# Altium schematic sheet as14120_fpga_ddr.SchDoc
size A3; PageSetup: Record=PageOptions|CenterHorizontal=True|CenterVertical=True|PrintScale=1.02|XCorrection=1.00|YCorrection=1.00|PrintKind=1|BorderSize=5000000|LeftOffset=0|BottomOffset=0|Orientation=2|PaperLength=4200|PaperWidth=2970|Scale=100|PaperSource=7|PrintQuality=-4|MediaType=1|DitherType=10|PaperKind=A3 (бумага продольной резки) (297 x 420 мм)|PrintScaleMode=1
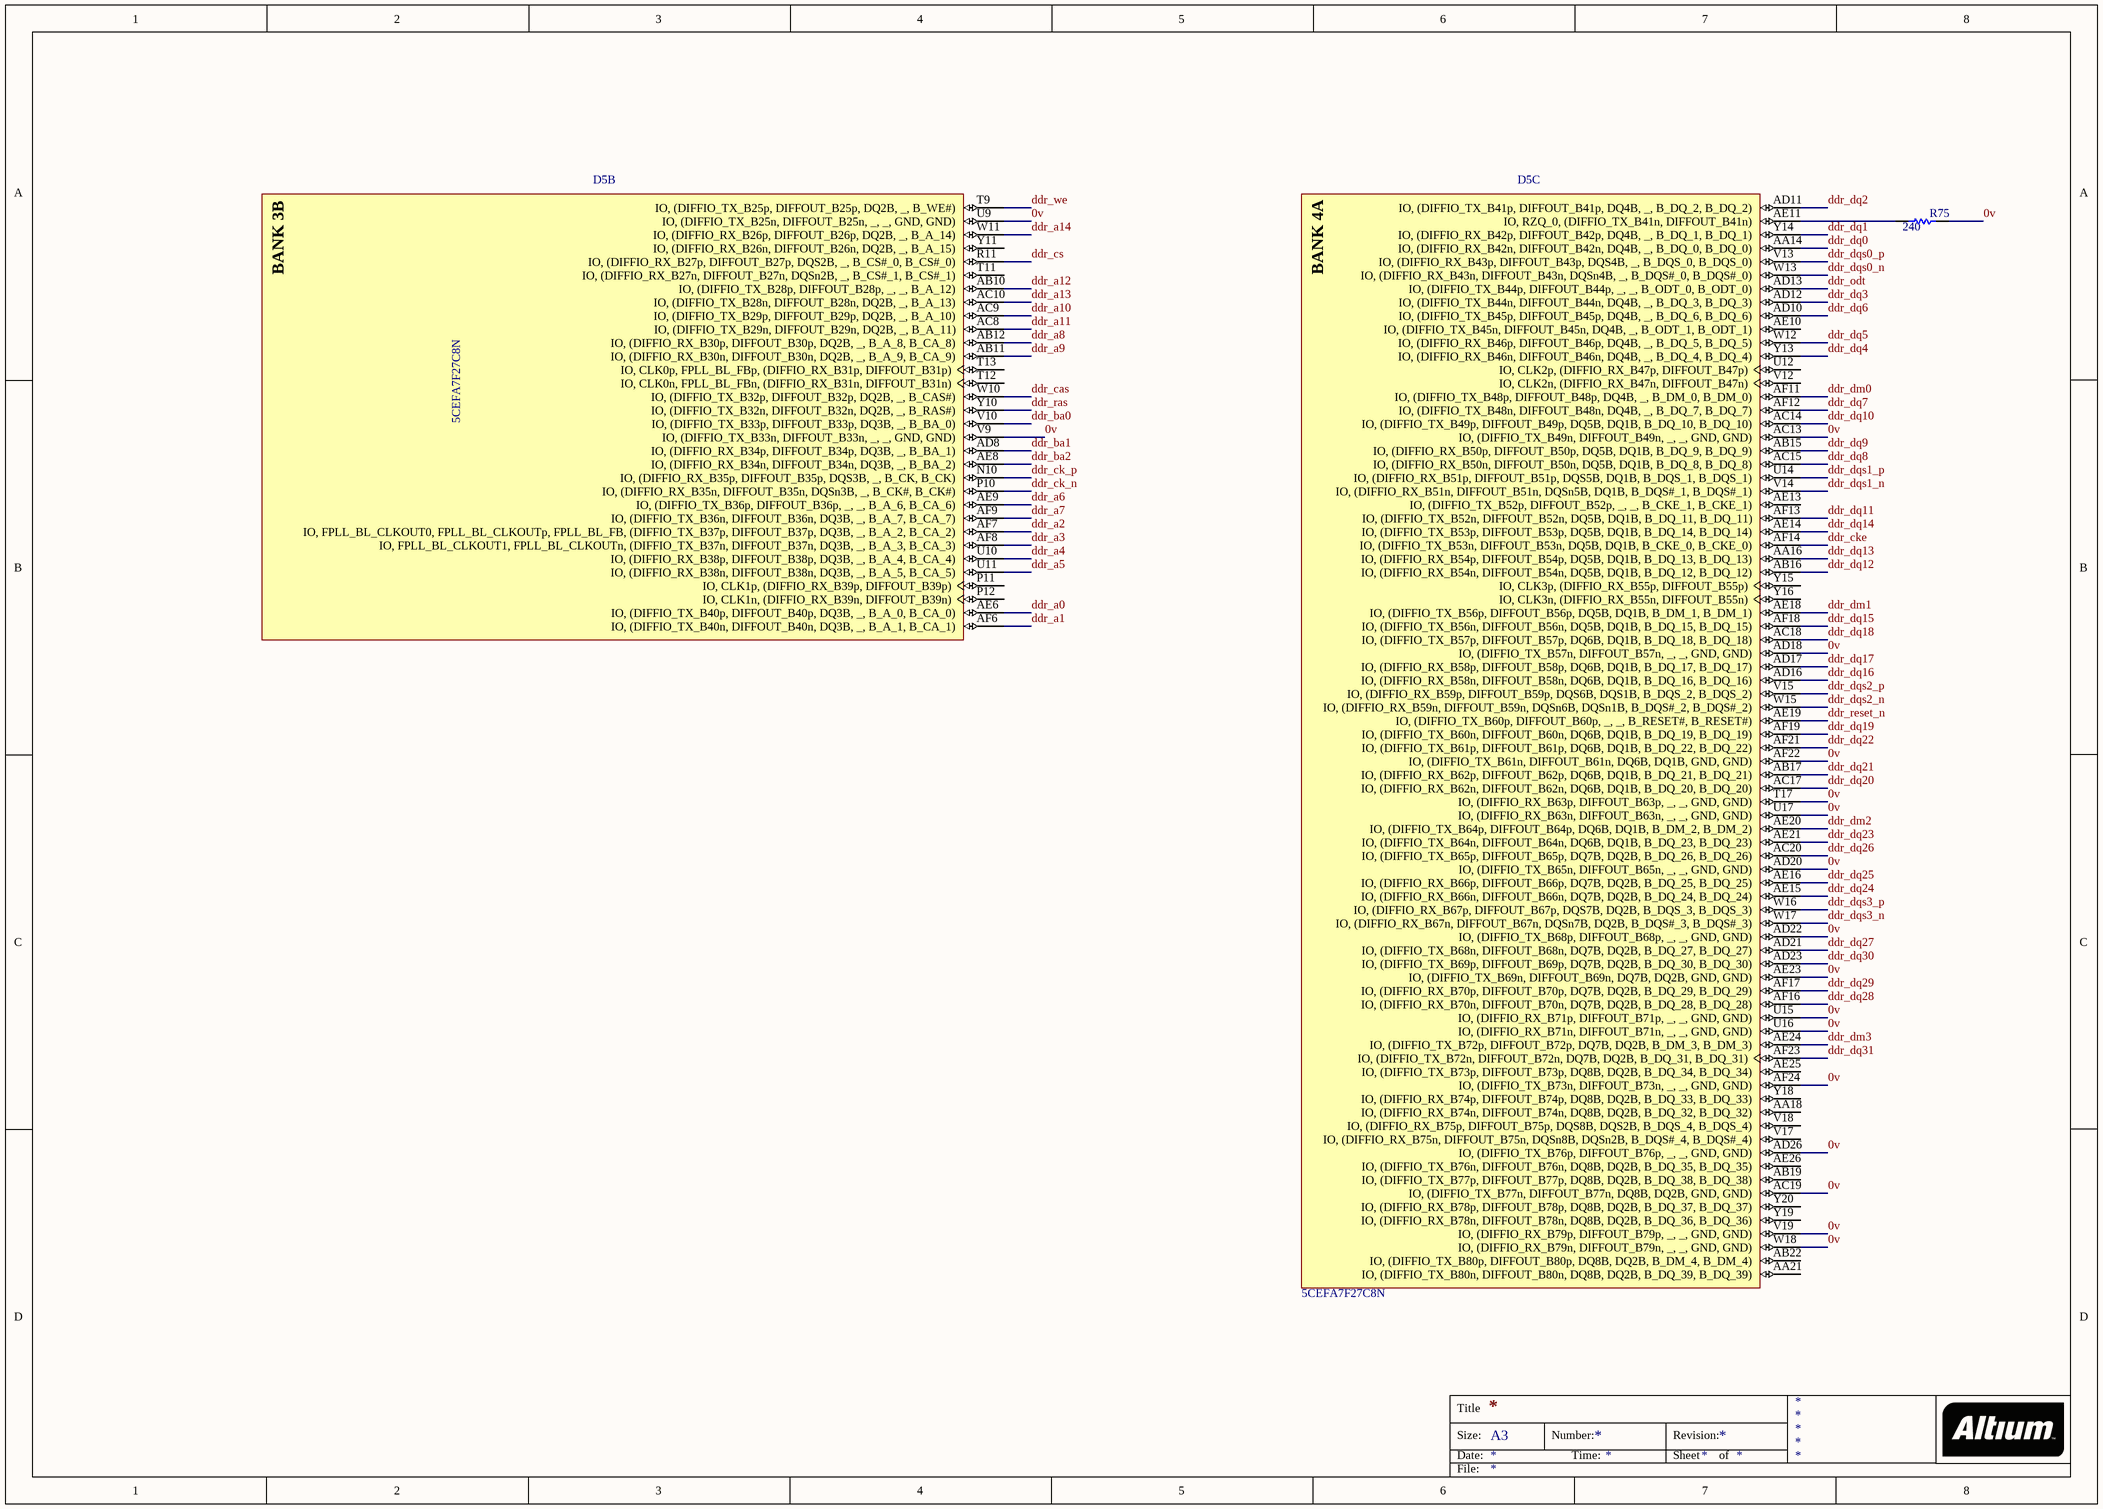
[diagram p0: as14120_fpga_ddr.SchDoc]

## Parts
D5  5CEFA7F27C8N  [ALTR-672-FBGA-2000A]  (parts B,C of 12)
R75  value 240  [RESC0805(2012)_L]  (hidden comment: 1K 1% 0805(2012))

## Nets
0v: D5.AC13(IO,_(DIFFIO_TX_B49n,_DIFFOUT_B49n,__,__,_GND,_GND)) D5.AC19(IO,_(DIFFIO_TX_B77n,_DIFFOUT_B77n,_DQ8B,_DQ2B,_GND,_GND)) D5.AD18(IO,_(DIFFIO_TX_B57n,_DIFFOUT_B57n,__,__,_GND,_GND)) D5.AD20(IO,_(DIFFIO_TX_B65n,_DIFFOUT_B65n,__,__,_GND,_GND)) D5.AD22(IO,_(DIFFIO_TX_B68p,_DIFFOUT_B68p,__,__,_GND,_GND)) D5.AD26(IO,_(DIFFIO_TX_B76p,_DIFFOUT_B76p,__,__,_GND,_GND)) D5.AE23(IO,_(DIFFIO_TX_B69n,_DIFFOUT_B69n,_DQ7B,_DQ2B,_GND,_GND)) D5.AF22(IO,_(DIFFIO_TX_B61n,_DIFFOUT_B61n,_DQ6B,_DQ1B,_GND,_GND)) D5.AF24(IO,_(DIFFIO_TX_B73n,_DIFFOUT_B73n,__,__,_GND,_GND)) D5.T17(IO,_(DIFFIO_RX_B63p,_DIFFOUT_B63p,__,__,_GND,_GND)) D5.U9(IO,_(DIFFIO_TX_B25n,_DIFFOUT_B25n,__,__,_GND,_GND)) D5.U15(IO,_(DIFFIO_RX_B71p,_DIFFOUT_B71p,__,__,_GND,_GND)) D5.U16(IO,_(DIFFIO_RX_B71n,_DIFFOUT_B71n,__,__,_GND,_GND)) D5.U17(IO,_(DIFFIO_RX_B63n,_DIFFOUT_B63n,__,__,_GND,_GND)) D5.V9(IO,_(DIFFIO_TX_B33n,_DIFFOUT_B33n,__,__,_GND,_GND)) D5.V19(IO,_(DIFFIO_RX_B79p,_DIFFOUT_B79p,__,__,_GND,_GND)) D5.W18(IO,_(DIFFIO_RX_B79n,_DIFFOUT_B79n,__,__,_GND,_GND)) R75.2
ddr_a0: D5.AE6(IO,_(DIFFIO_TX_B40p,_DIFFOUT_B40p,_DQ3B,__,_B_A_0,_B_CA_0))
ddr_a1: D5.AF6(IO,_(DIFFIO_TX_B40n,_DIFFOUT_B40n,_DQ3B,__,_B_A_1,_B_CA_1))
ddr_a2: D5.AF7(IO,_FPLL_BL_CLKOUT0,_FPLL_BL_CLKOUTp,_FPLL_BL_FB,_(DIFFIO_TX_B37p,_DIFFOUT_B37p,_DQ3B,__,_B_A_2,_B_CA_2))
ddr_a3: D5.AF8(IO,_FPLL_BL_CLKOUT1,_FPLL_BL_CLKOUTn,_(DIFFIO_TX_B37n,_DIFFOUT_B37n,_DQ3B,__,_B_A_3,_B_CA_3))
ddr_a4: D5.U10(IO,_(DIFFIO_RX_B38p,_DIFFOUT_B38p,_DQ3B,__,_B_A_4,_B_CA_4))
ddr_a5: D5.U11(IO,_(DIFFIO_RX_B38n,_DIFFOUT_B38n,_DQ3B,__,_B_A_5,_B_CA_5))
ddr_a6: D5.AE9(IO,_(DIFFIO_TX_B36p,_DIFFOUT_B36p,__,__,_B_A_6,_B_CA_6))
ddr_a7: D5.AF9(IO,_(DIFFIO_TX_B36n,_DIFFOUT_B36n,_DQ3B,__,_B_A_7,_B_CA_7))
ddr_a8: D5.AB12(IO,_(DIFFIO_RX_B30p,_DIFFOUT_B30p,_DQ2B,__,_B_A_8,_B_CA_8))
ddr_a9: D5.AB11(IO,_(DIFFIO_RX_B30n,_DIFFOUT_B30n,_DQ2B,__,_B_A_9,_B_CA_9))
ddr_a10: D5.AC9(IO,_(DIFFIO_TX_B29p,_DIFFOUT_B29p,_DQ2B,__,_B_A_10))
ddr_a11: D5.AC8(IO,_(DIFFIO_TX_B29n,_DIFFOUT_B29n,_DQ2B,__,_B_A_11))
ddr_a12: D5.AB10(IO,_(DIFFIO_TX_B28p,_DIFFOUT_B28p,__,__,_B_A_12))
ddr_a13: D5.AC10(IO,_(DIFFIO_TX_B28n,_DIFFOUT_B28n,_DQ2B,__,_B_A_13))
ddr_a14: D5.W11(IO,_(DIFFIO_RX_B26p,_DIFFOUT_B26p,_DQ2B,__,_B_A_14))
ddr_ba0: D5.V10(IO,_(DIFFIO_TX_B33p,_DIFFOUT_B33p,_DQ3B,__,_B_BA_0))
ddr_ba1: D5.AD8(IO,_(DIFFIO_RX_B34p,_DIFFOUT_B34p,_DQ3B,__,_B_BA_1))
ddr_ba2: D5.AE8(IO,_(DIFFIO_RX_B34n,_DIFFOUT_B34n,_DQ3B,__,_B_BA_2))
ddr_cas: D5.W10(IO,_(DIFFIO_TX_B32p,_DIFFOUT_B32p,_DQ2B,__,_B_CAS#))
ddr_ck_n: D5.P10(IO,_(DIFFIO_RX_B35n,_DIFFOUT_B35n,_DQSn3B,__,_B_CK#,_B_CK#))
ddr_ck_p: D5.N10(IO,_(DIFFIO_RX_B35p,_DIFFOUT_B35p,_DQS3B,__,_B_CK,_B_CK))
ddr_cke: D5.AF14(IO,_(DIFFIO_TX_B53n,_DIFFOUT_B53n,_DQ5B,_DQ1B,_B_CKE_0,_B_CKE_0))
ddr_cs: D5.R11(IO,_(DIFFIO_RX_B27p,_DIFFOUT_B27p,_DQS2B,__,_B_CS#_0,_B_CS#_0))
ddr_dm0: D5.AF11(IO,_(DIFFIO_TX_B48p,_DIFFOUT_B48p,_DQ4B,__,_B_DM_0,_B_DM_0))
ddr_dm1: D5.AE18(IO,_(DIFFIO_TX_B56p,_DIFFOUT_B56p,_DQ5B,_DQ1B,_B_DM_1,_B_DM_1))
ddr_dm2: D5.AE20(IO,_(DIFFIO_TX_B64p,_DIFFOUT_B64p,_DQ6B,_DQ1B,_B_DM_2,_B_DM_2))
ddr_dm3: D5.AE24(IO,_(DIFFIO_TX_B72p,_DIFFOUT_B72p,_DQ7B,_DQ2B,_B_DM_3,_B_DM_3))
ddr_dq0: D5.AA14(IO,_(DIFFIO_RX_B42n,_DIFFOUT_B42n,_DQ4B,__,_B_DQ_0,_B_DQ_0))
ddr_dq1: D5.Y14(IO,_(DIFFIO_RX_B42p,_DIFFOUT_B42p,_DQ4B,__,_B_DQ_1,_B_DQ_1))
ddr_dq2: D5.AD11(IO,_(DIFFIO_TX_B41p,_DIFFOUT_B41p,_DQ4B,__,_B_DQ_2,_B_DQ_2))
ddr_dq3: D5.AD12(IO,_(DIFFIO_TX_B44n,_DIFFOUT_B44n,_DQ4B,__,_B_DQ_3,_B_DQ_3))
ddr_dq4: D5.Y13(IO,_(DIFFIO_RX_B46n,_DIFFOUT_B46n,_DQ4B,__,_B_DQ_4,_B_DQ_4))
ddr_dq5: D5.W12(IO,_(DIFFIO_RX_B46p,_DIFFOUT_B46p,_DQ4B,__,_B_DQ_5,_B_DQ_5))
ddr_dq6: D5.AD10(IO,_(DIFFIO_TX_B45p,_DIFFOUT_B45p,_DQ4B,__,_B_DQ_6,_B_DQ_6))
ddr_dq7: D5.AF12(IO,_(DIFFIO_TX_B48n,_DIFFOUT_B48n,_DQ4B,__,_B_DQ_7,_B_DQ_7))
ddr_dq8: D5.AC15(IO,_(DIFFIO_RX_B50n,_DIFFOUT_B50n,_DQ5B,_DQ1B,_B_DQ_8,_B_DQ_8))
ddr_dq9: D5.AB15(IO,_(DIFFIO_RX_B50p,_DIFFOUT_B50p,_DQ5B,_DQ1B,_B_DQ_9,_B_DQ_9))
ddr_dq10: D5.AC14(IO,_(DIFFIO_TX_B49p,_DIFFOUT_B49p,_DQ5B,_DQ1B,_B_DQ_10,_B_DQ_10))
ddr_dq11: D5.AF13(IO,_(DIFFIO_TX_B52n,_DIFFOUT_B52n,_DQ5B,_DQ1B,_B_DQ_11,_B_DQ_11))
ddr_dq12: D5.AB16(IO,_(DIFFIO_RX_B54n,_DIFFOUT_B54n,_DQ5B,_DQ1B,_B_DQ_12,_B_DQ_12))
ddr_dq13: D5.AA16(IO,_(DIFFIO_RX_B54p,_DIFFOUT_B54p,_DQ5B,_DQ1B,_B_DQ_13,_B_DQ_13))
ddr_dq14: D5.AE14(IO,_(DIFFIO_TX_B53p,_DIFFOUT_B53p,_DQ5B,_DQ1B,_B_DQ_14,_B_DQ_14))
ddr_dq15: D5.AF18(IO,_(DIFFIO_TX_B56n,_DIFFOUT_B56n,_DQ5B,_DQ1B,_B_DQ_15,_B_DQ_15))
ddr_dq16: D5.AD16(IO,_(DIFFIO_RX_B58n,_DIFFOUT_B58n,_DQ6B,_DQ1B,_B_DQ_16,_B_DQ_16))
ddr_dq17: D5.AD17(IO,_(DIFFIO_RX_B58p,_DIFFOUT_B58p,_DQ6B,_DQ1B,_B_DQ_17,_B_DQ_17))
ddr_dq18: D5.AC18(IO,_(DIFFIO_TX_B57p,_DIFFOUT_B57p,_DQ6B,_DQ1B,_B_DQ_18,_B_DQ_18))
ddr_dq19: D5.AF19(IO,_(DIFFIO_TX_B60n,_DIFFOUT_B60n,_DQ6B,_DQ1B,_B_DQ_19,_B_DQ_19))
ddr_dq20: D5.AC17(IO,_(DIFFIO_RX_B62n,_DIFFOUT_B62n,_DQ6B,_DQ1B,_B_DQ_20,_B_DQ_20))
ddr_dq21: D5.AB17(IO,_(DIFFIO_RX_B62p,_DIFFOUT_B62p,_DQ6B,_DQ1B,_B_DQ_21,_B_DQ_21))
ddr_dq22: D5.AF21(IO,_(DIFFIO_TX_B61p,_DIFFOUT_B61p,_DQ6B,_DQ1B,_B_DQ_22,_B_DQ_22))
ddr_dq23: D5.AE21(IO,_(DIFFIO_TX_B64n,_DIFFOUT_B64n,_DQ6B,_DQ1B,_B_DQ_23,_B_DQ_23))
ddr_dq24: D5.AE15(IO,_(DIFFIO_RX_B66n,_DIFFOUT_B66n,_DQ7B,_DQ2B,_B_DQ_24,_B_DQ_24))
ddr_dq25: D5.AE16(IO,_(DIFFIO_RX_B66p,_DIFFOUT_B66p,_DQ7B,_DQ2B,_B_DQ_25,_B_DQ_25))
ddr_dq26: D5.AC20(IO,_(DIFFIO_TX_B65p,_DIFFOUT_B65p,_DQ7B,_DQ2B,_B_DQ_26,_B_DQ_26))
ddr_dq27: D5.AD21(IO,_(DIFFIO_TX_B68n,_DIFFOUT_B68n,_DQ7B,_DQ2B,_B_DQ_27,_B_DQ_27))
ddr_dq28: D5.AF16(IO,_(DIFFIO_RX_B70n,_DIFFOUT_B70n,_DQ7B,_DQ2B,_B_DQ_28,_B_DQ_28))
ddr_dq29: D5.AF17(IO,_(DIFFIO_RX_B70p,_DIFFOUT_B70p,_DQ7B,_DQ2B,_B_DQ_29,_B_DQ_29))
ddr_dq30: D5.AD23(IO,_(DIFFIO_TX_B69p,_DIFFOUT_B69p,_DQ7B,_DQ2B,_B_DQ_30,_B_DQ_30))
ddr_dq31: D5.AF23(IO,_(DIFFIO_TX_B72n,_DIFFOUT_B72n,_DQ7B,_DQ2B,_B_DQ_31,_B_DQ_31))
ddr_dqs0_n: D5.W13(IO,_(DIFFIO_RX_B43n,_DIFFOUT_B43n,_DQSn4B,__,_B_DQS#_0,_B_DQS#_0))
ddr_dqs0_p: D5.V13(IO,_(DIFFIO_RX_B43p,_DIFFOUT_B43p,_DQS4B,__,_B_DQS_0,_B_DQS_0))
ddr_dqs1_n: D5.V14(IO,_(DIFFIO_RX_B51n,_DIFFOUT_B51n,_DQSn5B,_DQ1B,_B_DQS#_1,_B_DQS#_1))
ddr_dqs1_p: D5.U14(IO,_(DIFFIO_RX_B51p,_DIFFOUT_B51p,_DQS5B,_DQ1B,_B_DQS_1,_B_DQS_1))
ddr_dqs2_n: D5.W15(IO,_(DIFFIO_RX_B59n,_DIFFOUT_B59n,_DQSn6B,_DQSn1B,_B_DQS#_2,_B_DQS#_2))
ddr_dqs2_p: D5.V15(IO,_(DIFFIO_RX_B59p,_DIFFOUT_B59p,_DQS6B,_DQS1B,_B_DQS_2,_B_DQS_2))
ddr_dqs3_n: D5.W17(IO,_(DIFFIO_RX_B67n,_DIFFOUT_B67n,_DQSn7B,_DQ2B,_B_DQS#_3,_B_DQS#_3))
ddr_dqs3_p: D5.W16(IO,_(DIFFIO_RX_B67p,_DIFFOUT_B67p,_DQS7B,_DQ2B,_B_DQS_3,_B_DQS_3))
ddr_odt: D5.AD13(IO,_(DIFFIO_TX_B44p,_DIFFOUT_B44p,__,__,_B_ODT_0,_B_ODT_0))
ddr_ras: D5.Y10(IO,_(DIFFIO_TX_B32n,_DIFFOUT_B32n,_DQ2B,__,_B_RAS#))
ddr_reset_n: D5.AE19(IO,_(DIFFIO_TX_B60p,_DIFFOUT_B60p,__,__,_B_RESET#,_B_RESET#))
ddr_we: D5.T9(IO,_(DIFFIO_TX_B25p,_DIFFOUT_B25p,_DQ2B,__,_B_WE#))
NetD5_AE11: D5.AE11(IO,_RZQ_0,_(DIFFIO_TX_B41n,_DIFFOUT_B41n)) R75.1

Not connected (* = marked no-connect by the designer): D5 AA18(IO,_(DIFFIO_RX_B74n,_DIFFOUT_B74n,_DQ8B,_DQ2B,_B_DQ_32,_B_DQ_32)) AA21(IO,_(DIFFIO_TX_B80n,_DIFFOUT_B80n,_DQ8B,_DQ2B,_B_DQ_39,_B_DQ_39)) AB19(IO,_(DIFFIO_TX_B77p,_DIFFOUT_B77p,_DQ8B,_DQ2B,_B_DQ_38,_B_DQ_38)) AB22(IO,_(DIFFIO_TX_B80p,_DIFFOUT_B80p,_DQ8B,_DQ2B,_B_DM_4,_B_DM_4)) AE10(IO,_(DIFFIO_TX_B45n,_DIFFOUT_B45n,_DQ4B,__,_B_ODT_1,_B_ODT_1)) AE13(IO,_(DIFFIO_TX_B52p,_DIFFOUT_B52p,__,__,_B_CKE_1,_B_CKE_1)) AE25(IO,_(DIFFIO_TX_B73p,_DIFFOUT_B73p,_DQ8B,_DQ2B,_B_DQ_34,_B_DQ_34)) AE26(IO,_(DIFFIO_TX_B76n,_DIFFOUT_B76n,_DQ8B,_DQ2B,_B_DQ_35,_B_DQ_35)) P11(IO,_CLK1p,_(DIFFIO_RX_B39p,_DIFFOUT_B39p)) P12(IO,_CLK1n,_(DIFFIO_RX_B39n,_DIFFOUT_B39n)) T11(IO,_(DIFFIO_RX_B27n,_DIFFOUT_B27n,_DQSn2B,__,_B_CS#_1,_B_CS#_1)) T12(IO,_CLK0n,_FPLL_BL_FBn,_(DIFFIO_RX_B31n,_DIFFOUT_B31n)) T13(IO,_CLK0p,_FPLL_BL_FBp,_(DIFFIO_RX_B31p,_DIFFOUT_B31p)) U12(IO,_CLK2p,_(DIFFIO_RX_B47p,_DIFFOUT_B47p)) V12(IO,_CLK2n,_(DIFFIO_RX_B47n,_DIFFOUT_B47n)) V17(IO,_(DIFFIO_RX_B75n,_DIFFOUT_B75n,_DQSn8B,_DQSn2B,_B_DQS#_4,_B_DQS#_4)) V18(IO,_(DIFFIO_RX_B75p,_DIFFOUT_B75p,_DQS8B,_DQS2B,_B_DQS_4,_B_DQS_4)) Y11(IO,_(DIFFIO_RX_B26n,_DIFFOUT_B26n,_DQ2B,__,_B_A_15)) Y15(IO,_CLK3p,_(DIFFIO_RX_B55p,_DIFFOUT_B55p)) Y16(IO,_CLK3n,_(DIFFIO_RX_B55n,_DIFFOUT_B55n)) Y18(IO,_(DIFFIO_RX_B74p,_DIFFOUT_B74p,_DQ8B,_DQ2B,_B_DQ_33,_B_DQ_33)) Y19(IO,_(DIFFIO_RX_B78n,_DIFFOUT_B78n,_DQ8B,_DQ2B,_B_DQ_36,_B_DQ_36)) Y20(IO,_(DIFFIO_RX_B78p,_DIFFOUT_B78p,_DQ8B,_DQ2B,_B_DQ_37,_B_DQ_37))

## Notes on the sheet
- Title
- Size:
- Date:
- A3
- Number:
- Time:
- Revision:
- Sheet
- of
- File:
- (in symbol 5CEFA7F27C8N, part B) BANK 3B
- (in symbol 5CEFA7F27C8N, part C) BANK 4A

## Library data of the parts
D5 = 5CEFA7F27C8N: Cyclone V E Family FPGA, 1.07 to 1.13 V Supply, 336 I/O Pins, 7 PLLs, 672-Pin FBGA, Speed Grade 8, Commercial Grade, RoHS Compliant; Manufacturer: Altera; Device Group: 5CEFA7; GPIO: 336; Logic Elements (LE) (K): 149.5; Speed Grade: 8; DatasheetVersion: Rev. 3.1; PackageReference: 672-FBGA-2000A; PackageDescription: 672-Pin FineLine Ball-Grid Array (FBGA), Body 27 x 27 mm, Pitch 1 mm; Supplier 1: Digi-Key; Supplier Part Number 1: 5CEFA7F27C8N-ND; Supplier 2: Mouser; Supplier Part Number 2: 989-5CEFA7F27C8N; RoHS: RoHS Compliant; Subcategory: Cyclone V E; Voltage Supply: 1.07 to 1.13 V; Mounting Technology: Surface Mount; Code_JEDEC: MS-034-AAL-1; PartNumber: 5CEFA7F27C8N; ComponentLink1Description: Manufacturer URL; ComponentLink1URL: http://www.altera.com; ComponentLink2Description: Datasheet; ComponentLink2URL: http://www.altera.com/literature/hb/cyclone-v/cv_51002.pdf; ComponentLink3Description: Package Specification; ComponentLink3URL: http://www.altera.com/devicepackaging/04R00427-01.pdf; ComponentLink4Description: Device Handbook URL; ComponentLink4URL: http://www.altera.com/literature/hb/cyclone-v/cyclone5_handbook.pdf; ComponentLink5Description: Device Overview URL; ComponentLink5URL: http://www.altera.com/literature/hb/cyclone-v/cv_51001.pdf; ComponentLink6Description: Device Pin-Out URL; ComponentLink6URL: http://www.altera.com/literature/dp/cyclone-v/1.1.txt; ComponentLink7Description: Product URL; ComponentLink7URL: http://www.buyaltera.com/scripts/partsearch.dll?Detail&name=5CEFA7F27C8N-ND
R75 = RES_0805: 1K 0.125W 1% 0805 (2012 Metric)  SMD; Case-Metric: 2012; Case-EIA: 0805; Tolerance: 1 %; Power: 0.125 W; Technology: SMT